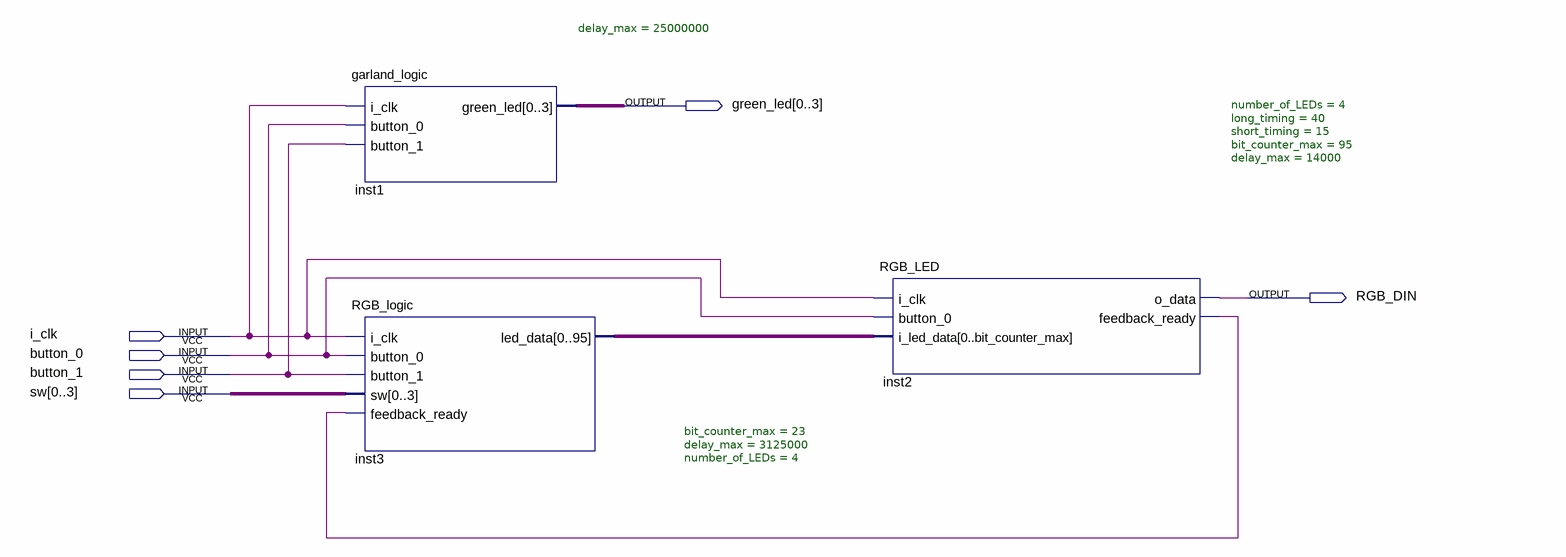
[diagram p0: schematic sheet]
// Quartus schematic garland.bdf as structural Verilog: 3 symbols, 6 pins
module garland (
  input  i_clk,
  input  button_0,
  input  button_1,
  input  [0:3] sw,
  output [0:3] green_led,
  output RGB_DIN
);

  wire inst2_feedback_ready;
  wire [95:0] inst3_led_data;

  garland_logic #(.delay_max(25000000)) inst1 (
    .i_clk(i_clk), .button_0(button_0), .button_1(button_1), .green_led(green_led));
  RGB_logic #(.bit_counter_max(23), .delay_max(3125000), .number_of_LEDs(4)) inst3 (
    .i_clk(i_clk), .button_0(button_0), .button_1(button_1), .sw(sw), .feedback_ready(inst2_feedback_ready),
    .led_data(inst3_led_data));
  RGB_LED #(.number_of_LEDs(4), .long_timing(40), .short_timing(15), .bit_counter_max(95), .delay_max(14000)) inst2 (
    .i_clk(i_clk), .button_0(button_0), .i_led_data(inst3_led_data), .o_data(RGB_DIN),
    .feedback_ready(inst2_feedback_ready));
endmodule
